# EAGLE schematic orao_keyboard (EAGLE 9.6.2)
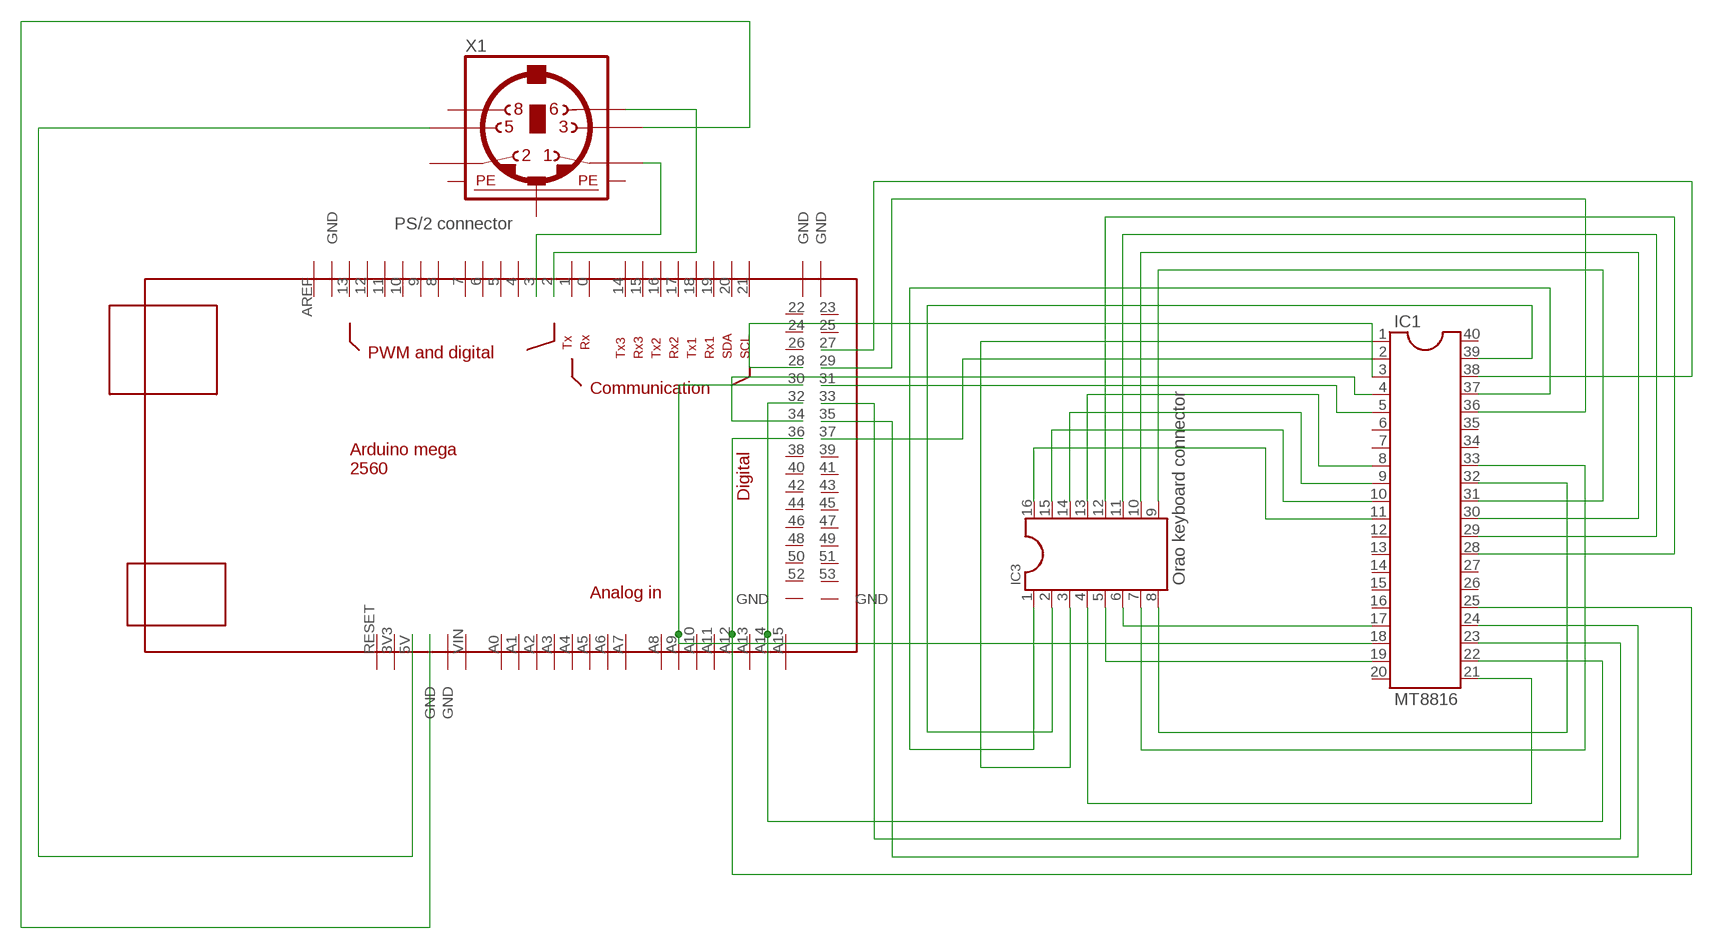
[diagram p0: schematic, sheet 1]

## Parts
IC1  MT8816  DIL40  [DIL40]
IC3  Orao keyboard connector  DIL16S  [SOCKED-16]
U$1  MEGA_DEVICE  [MEGAOUTLINE]
X1  PS/2 connector  MINI_DIN_6  [M_DIN6]

## Nets
N$1: IC1.37 IC3.1
N$2: IC1.39 IC3.2
N$3: IC1.1 IC3.3
N$4: IC1.21 IC3.4
N$5: IC1.19 IC3.5
N$6: IC1.17 IC3.6
N$7: IC1.33 IC3.7
N$8: IC1.32 IC3.8
N$9: IC1.31 IC3.9
N$10: IC1.30 IC3.10
N$11: IC1.29 IC3.11
N$12: IC1.28 IC3.12
N$13: IC1.8 IC3.13
N$14: IC1.9 IC3.14
N$15: IC1.10 IC3.15
N$16: IC1.11 IC3.16
N$17: IC1.5 U$1.31
N$18: IC1.22 U$1.32 U$1.A14
N$19: IC1.23 U$1.33
N$20: IC1.4 U$1.34
N$21: IC1.24 U$1.35
N$22: IC1.25 U$1.36 U$1.A12
N$23: IC1.2 U$1.37
N$24: IC1.18 U$1.30 U$1.A9
N$25: IC1.36 U$1.29
N$26: IC1.3 U$1.28
N$27: IC1.38 U$1.27
N$28: U$1.2 X1.6
N$29: U$1.3 X1.1
N$30: U$1.5V X1.5
N$31: U$1.GND@2(GND) X1.3
Unconnected: IC1.6 IC1.7 IC1.12 IC1.13 IC1.14 IC1.15 IC1.16 IC1.20 IC1.26 IC1.27 IC1.34 IC1.35 IC1.40 U$1.0 U$1.1 U$1.3V3 U$1.4 U$1.5 U$1.6 U$1.7 U$1.8 U$1.9 U$1.10 U$1.11 U$1.12 U$1.13 U$1.14 U$1.15 U$1.16 U$1.17 U$1.18 U$1.19 U$1.20 U$1.21 U$1.22 U$1.23 U$1.24 U$1.25 U$1.26 U$1.38 U$1.39 U$1.40 U$1.41 U$1.42 U$1.43 U$1.44 U$1.45 U$1.46 U$1.47 U$1.48 U$1.49 U$1.50 U$1.51 U$1.52 U$1.53 U$1.A0 U$1.A1 U$1.A2 U$1.A3 U$1.A4 U$1.A5 U$1.A6 U$1.A7 U$1.A8 U$1.A10 U$1.A11 U$1.A13 U$1.A15 U$1.AREF U$1.GND@1(GND) U$1.GND@3(GND) U$1.GND@4(GND) U$1.GND@5(GND) U$1.GND@6(GND) U$1.GND@7(GND) U$1.RESET U$1.VIN X1.2 X1.8

## Power pins joined to a net without a drawn wire
PE1: X1.SH1(PE1)
PE2: X1.SH2(PE2)
PE3: X1.SH3(PE3)

## Library data of the parts
IC1 = ic-package:DIL40: Dual In Line
IC3 = ic-package:DIL16: Dual In Line
U$1 = ArduinoMegaOutline:MEGA_DEVICE: mega card as device
X1 = mini_din:MINI_DIN_6